# Altium schematic sheet M2Sdut.SchDoc
size Tabloid
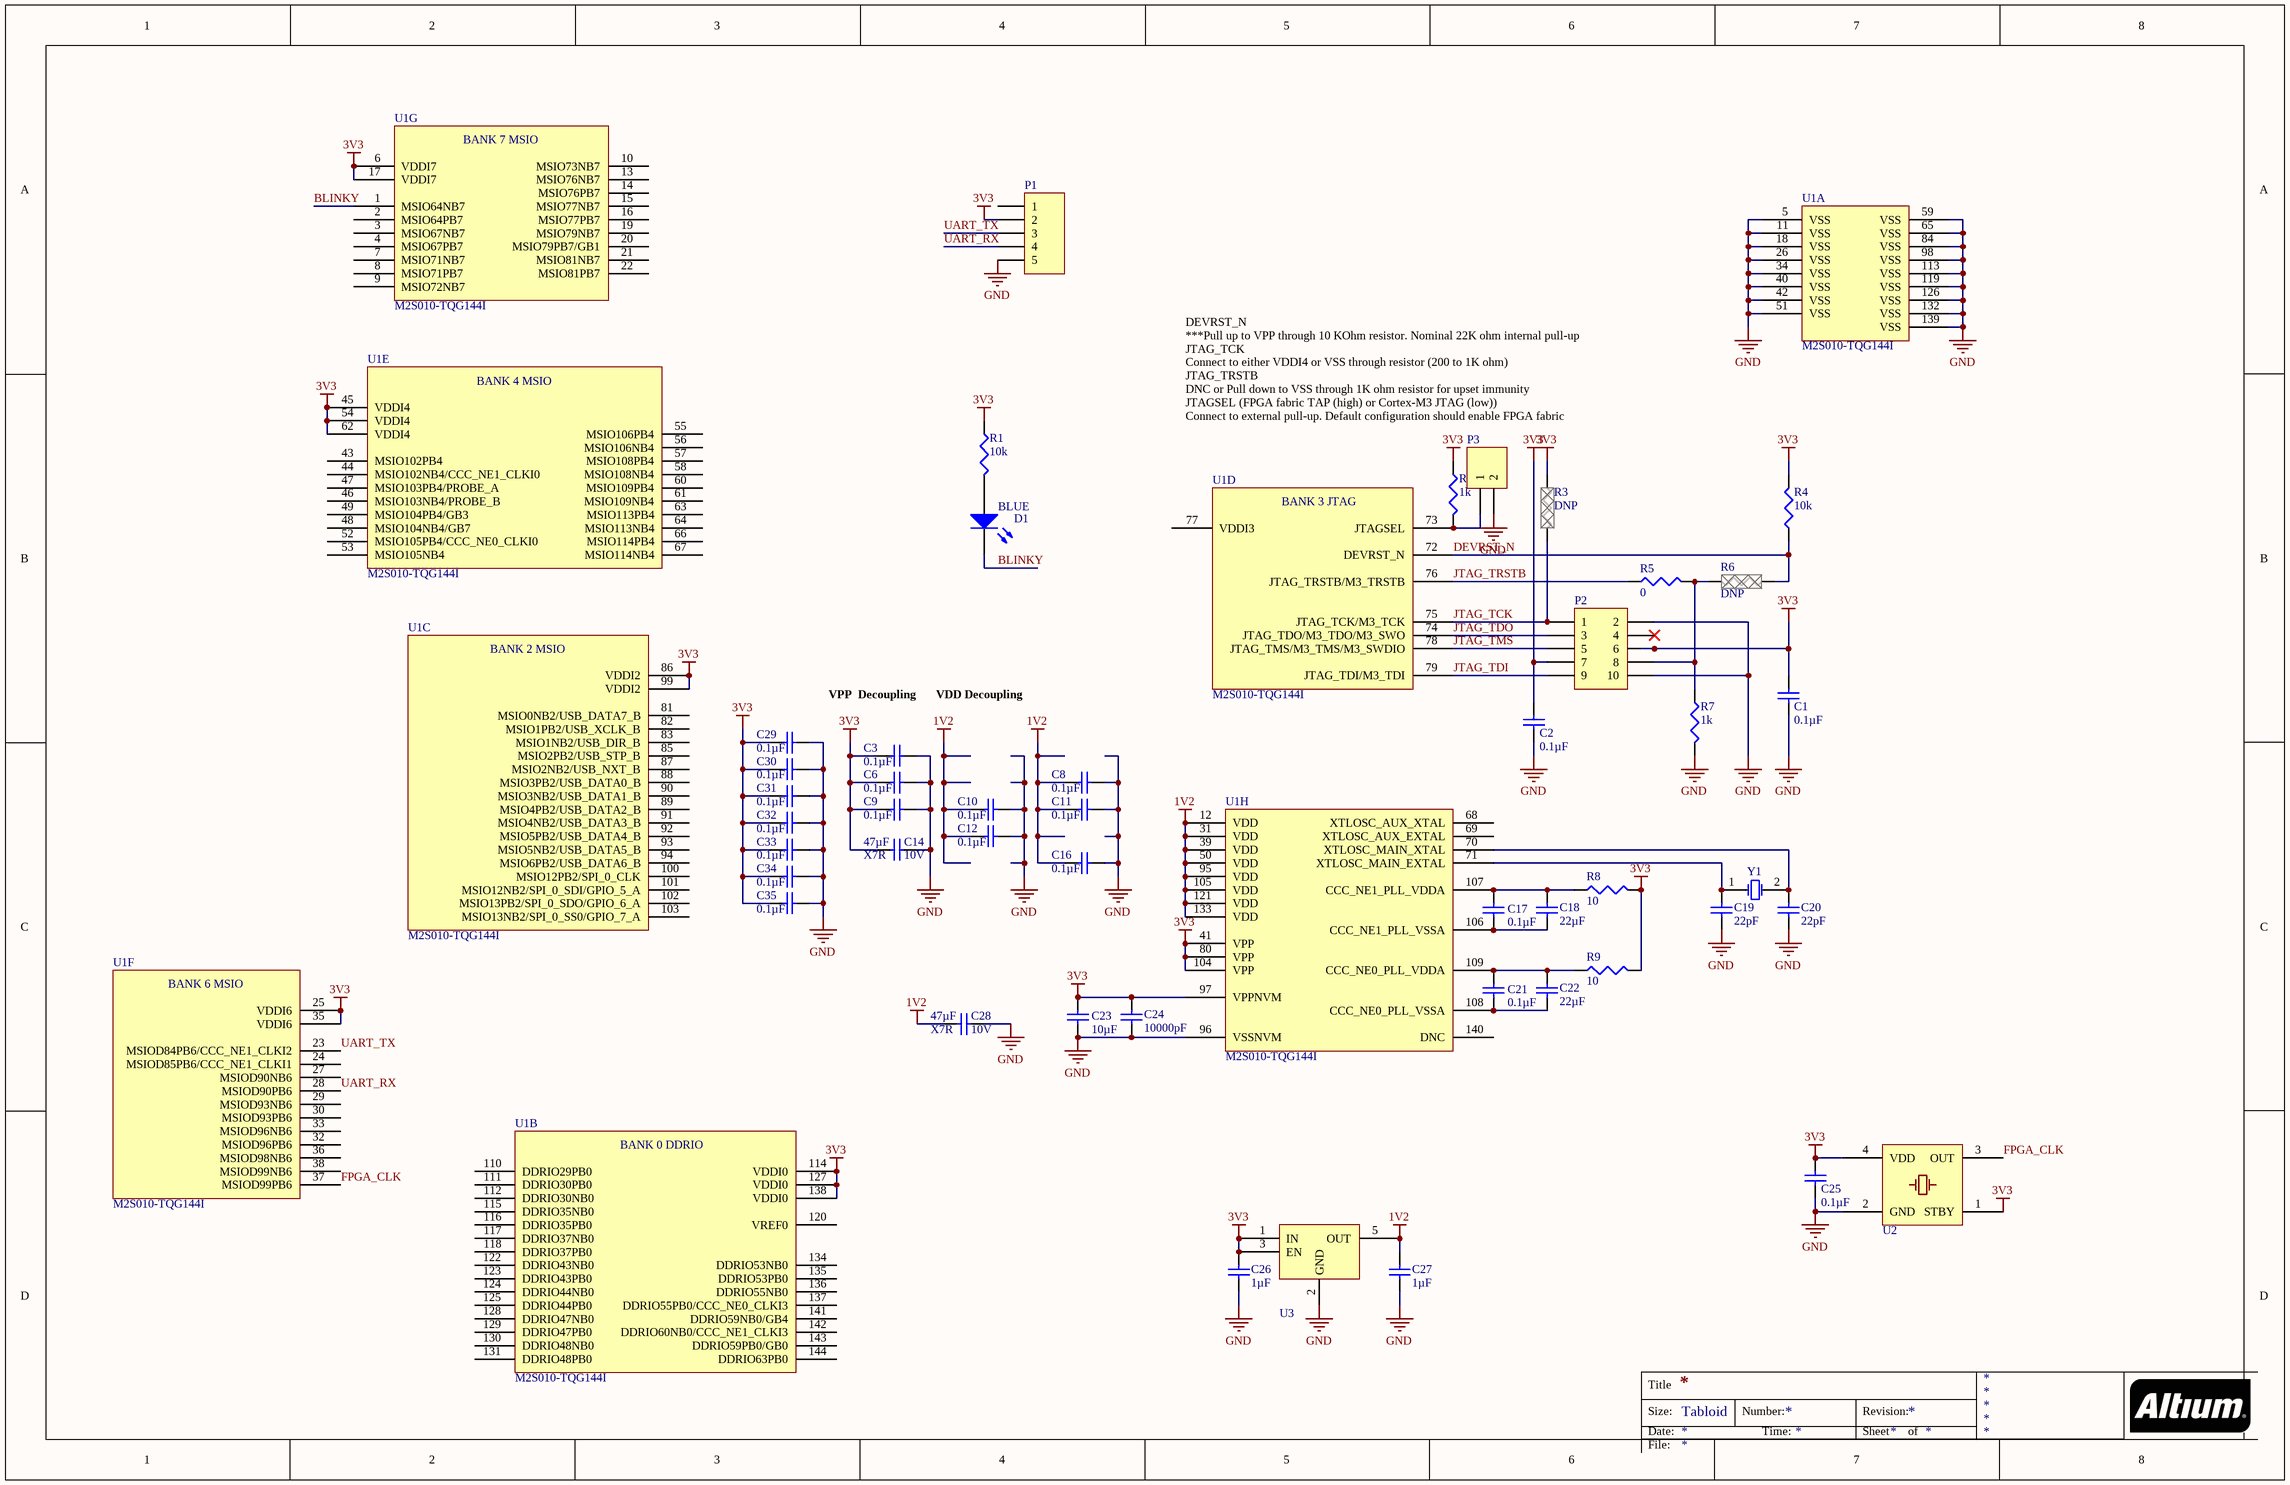
[diagram p0: M2Sdut.SchDoc]

## Parts
C1  value 0.1µF  [TDK-CGA3E]  (hidden comment: Cap)
C2  value 0.1µF  [TDK-CGA3E]  (hidden comment: Cap)
C3  value 0.1µF  [TDK-CGA3E]  (hidden comment: Cap)
C6  value 0.1µF  [TDK-CGA3E]  (hidden comment: Cap)
C8  value 0.1µF  [TDK-CGA3E]  (hidden comment: Cap)
C9  value 0.1µF  [TDK-CGA3E]  (hidden comment: Cap)
C10  value 0.1µF  [TDK-CGA3E]  (hidden comment: Cap)
C11  value 0.1µF  [TDK-CGA3E]  (hidden comment: Cap)
C12  value 0.1µF  [TDK-CGA3E]  (hidden comment: Cap)
C14  value 47µF  Voltage-Rated: 10V  Temperature Coefficient: X7R  [TY-1210M]  (hidden comment: Cap)
C16  value 0.1µF  [TDK-CGA3E]  (hidden comment: Cap)
C17  value 0.1µF  [TDK-CGA3E]  (hidden comment: Cap)
C18  value 22µF  [TY-0805G]  (hidden comment: Cap)
C19  value 22pF  [TDK-CGA3E]  (hidden comment: Cap)
C20  value 22pF  [TDK-CGA3E]  (hidden comment: Cap)
C21  value 0.1µF  [TDK-CGA3E]  (hidden comment: Cap)
C22  value 22µF  [TY-0805G]  (hidden comment: Cap)
C23  value 10µF  [TDK-CGA5L]  (hidden comment: Cap)
C24  value 10000pF  [TDK-CGA3E]  (hidden comment: Cap)
C25  value 0.1µF  [TDK-CGA3E]  (hidden comment: Cap)
C26  value 1µF  [TDK-CGA3E]  (hidden comment: Cap)
C27  value 1µF  [TDK-CGA3E]  (hidden comment: Cap)
C28  value 47µF  Voltage-Rated: 10V  Temperature Coefficient: X7R  [TY-1210M]  (hidden comment: Cap)
C29  value 0.1µF  [TDK-CGA3E]  (hidden comment: Cap)
C30  value 0.1µF  [TDK-CGA3E]  (hidden comment: Cap)
C31  value 0.1µF  [TDK-CGA3E]  (hidden comment: Cap)
C32  value 0.1µF  [TDK-CGA3E]  (hidden comment: Cap)
C33  value 0.1µF  [TDK-CGA3E]  (hidden comment: Cap)
C34  value 0.1µF  [TDK-CGA3E]  (hidden comment: Cap)
C35  value 0.1µF  [TDK-CGA3E]  (hidden comment: Cap)
D1  value BLUE  [WL-150060XS75000]  (hidden comment: LED)
P1  319-10-105-30-054000  [319-10-105-30-054000]  (value not drawn)
P2  Header 5x2  [SLN-GRPB052]  (value not drawn)
P3  Header 2  [SLN-GRPB021]  (value not drawn)
R1  value 10k  [PANA-ERJ3EK]  (hidden comment: Res3)
R2  value 1k  [PANA-ERJ3EK]  (hidden comment: Res3)
R3  DNP  [PANA-ERJ3G]  (no BOM)
R4  value 10k  [PANA-ERJ3EK]  (hidden comment: Res3)
R5  value 0  [PANA-ERJ3G]  (hidden comment: Jumper)
R6  DNP  [PANA-ERJ3G]  (no BOM)
R7  value 1k  [PANA-ERJ3EK]  (hidden comment: Res3)
R8  value 10  [PANA-ERJ3EK]  (hidden comment: Res3)
R9  value 10  [PANA-ERJ3EK]  (hidden comment: Res3)
U1  M2S010-TQG144I  [USEM-TQ144]  (parts A,B,C,D,E,F,G,H of 8)
U2  ASDMB  [ABR-ASDMB]  (value not drawn)
U3  LP5907  [TI-SOT25]  (value not drawn)
Y1  ABS07AIG  [ABR-ABS07AIG]  (value not drawn)

## Nets
1V2: C8.2 C10.2 C11.2 C12.2 C16.2 C27.2 C28.1 U1.12(VDD) U1.31(VDD) U1.39(VDD) U1.50(VDD) U1.95(VDD) U1.105(VDD) U1.121(VDD) U1.133(VDD) U3.5(OUT)
3V3: C1.2 C2.2 C3.2 C6.2 C9.2 C14.1 C23.2 C24.2 C25.2 C26.2 C29.2 C30.2 C31.2 C32.2 C33.2 C34.2 C35.2 P1.2 P2.6 P2.7 R1.2 R2.1 R3.1 R4.1 R8.2 R9.2 U1.6(VDDI7) U1.17(VDDI7) U1.25(VDDI6) U1.35(VDDI6) U1.41(VPP) U1.45(VDDI4) U1.54(VDDI4) U1.62(VDDI4) U1.80(VPP) U1.86(VDDI2) U1.97(VPPNVM) U1.99(VDDI2) U1.104(VPP) U1.114(VDDI0) U1.127(VDDI0) U1.138(VDDI0) U2.1(STBY) U2.4(VDD) U3.1(IN) U3.3(EN)
GND: C1.1 C2.1 C3.1 C6.1 C8.1 C9.1 C10.1 C11.1 C12.1 C14.2 C16.1 C19.1 C20.1 C23.1 C24.1 C25.1 C26.1 C27.1 C28.2 C29.1 C30.1 C31.1 C32.1 C33.1 C34.1 C35.1 P1.5 P2.2 P2.10 P3.2 R7.2 U1.5(VSS) U1.11(VSS) U1.18(VSS) U1.26(VSS) U1.34(VSS) U1.40(VSS) U1.42(VSS) U1.51(VSS) U1.59(VSS) U1.65(VSS) U1.84(VSS) U1.96(VSSNVM) U1.98(VSS) U1.113(VSS) U1.119(VSS) U1.126(VSS) U1.132(VSS) U1.139(VSS) U2.2(GND) U3.2(GND) U3.4(NC)
BLINKY: D1.2(K) U1.1(MSIO64NB7)
DEVRST_N: R4.2 R6.1 U1.72(DEVRST_N)
FPGA_CLK: U1.37(MSIOD99PB6) U2.3(OUT)
JTAG_TCK: P2.1 R3.2 U1.75(JTAG_TCK/M3_TCK)
JTAG_TDI: P2.9 U1.79(JTAG_TDI/M3_TDI)
JTAG_TDO: P2.3 U1.74(JTAG_TDO/M3_TDO/M3_SWO)
JTAG_TMS: P2.5 U1.78(JTAG_TMS/M3_TMS/M3_SWDIO)
JTAG_TRSTB: R5.1 U1.76(JTAG_TRSTB/M3_TRSTB)
UART_RX: P1.4 U1.28(MSIOD90PB6)
UART_TX: P1.3 U1.23(MSIOD84PB6/CCC_NE1_CLKI2)
NetC17_1: C17.1 C18.1 U1.106(CCC_NE1_PLL_VSSA)
NetC17_2: C17.2 C18.2 R8.1 U1.107(CCC_NE1_PLL_VDDA)
NetC19_2: C19.2 U1.71(XTLOSC_MAIN_EXTAL) Y1.1(OSC1)
NetC20_2: C20.2 U1.70(XTLOSC_MAIN_XTAL) Y1.2(OSC2)
NetC21_1: C21.1 C22.1 U1.108(CCC_NE0_PLL_VSSA)
NetC21_2: C21.2 C22.2 R9.1 U1.109(CCC_NE0_PLL_VDDA)
NetD1_1: D1.1(A) R1.1
NetP2_8: P2.8 R5.2 R6.2 R7.1
NetP3_1: P3.1 R2.2 U1.73(JTAGSEL)

Not connected (* = marked no-connect by the designer): P1 1; P2 4*; U1 2(MSIO64PB7) 3(MSIO67NB7) 4(MSIO67PB7) 7(MSIO71NB7) 8(MSIO71PB7) 9(MSIO72NB7) 10(MSIO73NB7) 13(MSIO76NB7) 14(MSIO76PB7) 15(MSIO77NB7) 16(MSIO77PB7) 19(MSIO79NB7) 20(MSIO79PB7/GB1) 21(MSIO81NB7) 22(MSIO81PB7) 24(MSIOD85PB6/CCC_NE1_CLKI1) 27(MSIOD90NB6) 29(MSIOD93NB6) 30(MSIOD93PB6) 32(MSIOD96PB6) 33(MSIOD96NB6) 36(MSIOD98NB6) 38(MSIOD99NB6) 43(MSIO102PB4) 44(MSIO102NB4/CCC_NE1_CLKI0) 46(MSIO103NB4/PROBE_B) 47(MSIO103PB4/PROBE_A) 48(MSIO104NB4/GB7) 49(MSIO104PB4/GB3) 52(MSIO105PB4/CCC_NE0_CLKI0) 53(MSIO105NB4) 55(MSIO106PB4) 56(MSIO106NB4) 57(MSIO108PB4) 58(MSIO108NB4) 60(MSIO109PB4) 61(MSIO109NB4) 63(MSIO113PB4) 64(MSIO113NB4) 66(MSIO114PB4) 67(MSIO114NB4) 68(XTLOSC_AUX_XTAL) 69(XTLOSC_AUX_EXTAL) 77(VDDI3) 81(MSIO0NB2/USB_DATA7_B) 82(MSIO1PB2/USB_XCLK_B) 83(MSIO1NB2/USB_DIR_B) 85(MSIO2PB2/USB_STP_B) 87(MSIO2NB2/USB_NXT_B) 88(MSIO3PB2/USB_DATA0_B) 89(MSIO4PB2/USB_DATA2_B) 90(MSIO3NB2/USB_DATA1_B) 91(MSIO4NB2/USB_DATA3_B) 92(MSIO5PB2/USB_DATA4_B) 93(MSIO5NB2/USB_DATA5_B) 94(MSIO6PB2/USB_DATA6_B) 100(MSIO12PB2/SPI_0_CLK) 101(MSIO12NB2/SPI_0_SDI/GPIO_5_A) 102(MSIO13PB2/SPI_0_SDO/GPIO_6_A) 103(MSIO13NB2/SPI_0_SS0/GPIO_7_A) 110(DDRIO29PB0) 111(DDRIO30PB0) 112(DDRIO30NB0) 115(DDRIO35NB0) 116(DDRIO35PB0) 117(DDRIO37NB0) 118(DDRIO37PB0) 120(VREF0) 122(DDRIO43NB0) 123(DDRIO43PB0) 124(DDRIO44NB0) 125(DDRIO44PB0) 128(DDRIO47NB0) 129(DDRIO47PB0) 130(DDRIO48NB0) 131(DDRIO48PB0) 134(DDRIO53NB0) 135(DDRIO53PB0) 136(DDRIO55NB0) 137(DDRIO55PB0/CCC_NE0_CLKI3) 140(DNC) 141(DDRIO59NB0/GB4) 142(DDRIO60NB0/CCC_NE1_CLKI3) 143(DDRIO59PB0/GB0) 144(DDRIO63PB0)

## Notes on the sheet
- DEVRST_N
  ***Pull up to VPP through 10 KOhm resistor. Nominal 22K ohm internal pull-up
  JTAG_TCK
  Connect to either VDDI4 or VSS through resistor (200 to 1K ohm)
  JTAG_TRSTB
  DNC or Pull down to VSS through 1K ohm resistor for upset immunity
  JTAGSEL (FPGA fabric TAP (high) or Cortex-M3 JTAG (low))
  Connect to external pull-up. Default configuration should enable FPGA fabric
- VPP  Decoupling
- VDD Decoupling
- Title
- Size:
- Date:
- Tabloid
- Number:
- Time:
- Revision:
- Sheet
- of
- File:
- (in symbol 2, part B) BANK 0 DDRIO
- (in symbol 2, part C) BANK 2 MSIO
- (in symbol 2, part D) BANK 3 JTAG
- (in symbol 2, part E) BANK 4 MSIO
- (in symbol 2, part F) BANK 6 MSIO
- (in symbol 2, part G) BANK 7 MSIO

## Library data of the parts
C1-C3 C6 C8-C12 C16 C17 C21 C25 C29-C35 = PC-TDK-02272: CAP CER 0.1UF 50V X8R 0603; Manufacturer Part Number: CGA3E3X8R1H104K080AB; Index: 2272; Tolerance: ±10%; Published: 3/16/2016; LatestRevisionDate: 3/16/2016; LatestRevisionNote: ...; PackageReference: 0603 (1608 Metric); Publisher: AlbertaSat; PackageDescription: Radial Cap, Thru-Hole; 2 Leads; 0.3 in Pin Spacing; Part Number: PC-TDK-02272; Supplier Part Number 1: 445-12606-1-ND; Supplier 1: Digi-key; Supplier Link: http://www.digikey.ca/product-search/en?keywords=445-12606-1-ND; Voltage - Rated: 50V; Temperature Coefficient: X8R; Applications: Automotive
C14 C28 = PC-TY-00765: CAP CER 47UF 10V X7R 1210; Manufacturer Part Number: LMK325B7476MM-TR; Index: 765; Tolerance: ±20%; Published: 3/13/2016; LatestRevisionDate: 3/13/2016; LatestRevisionNote: ...; PackageReference: 1210 (3225 Metric); Publisher: AlbertaSat; PackageDescription: Chip Capacitor, 2-Leads, Body 3.20x2.50mm, IPC Low Density; Part Number: PC-TY-00765; Supplier Part Number 1: 587-2783-1-ND; Supplier 1: Digi-key; Supplier Link: http://www.digikey.ca/product-search/en?keywords=587-2783-1-ND; Application: General Purpose
C18 C22 = PC-TY-00700: CAP CER 22UF 16V X5R 0805; Manufacturer Part Number: EMK212BBJ226MG-T; Index: 700; Designator: C?; Tolerance: ±20%; Published: 2016-03-13; LatestRevisionDate: 2016-03-13; LatestRevisionNote: ...; PackageReference: 0805 (2012 Metric); Publisher: AlbertaSat; PackageDescription: Chip Capacitor, 2-Leads, Body 2.00x1.25mm, IPC Low Density; Part Number: PC-TY-00700; Supplier Part Number 1: 587-3239-1-ND; Supplier 1: Digi-key; Supplier Link: http://www.digikey.ca/product-search/en?keywords=587-3239-1-ND; Voltage-Rated: 16V; Temperature Coefficient: X5R; Application: General Purpose
C19 C20 = PC-TDK-01150: CAP CER 22PF 100V NP0 0603; Manufacturer Part Number: CGA3E2NP02A220J080AA; Index: 1150; Designator: C?; Tolerance: ±5%; Published: 2016-03-16; LatestRevisionDate: 2016-03-16; LatestRevisionNote: ...; PackageReference: 0603 (1608 Metric); Publisher: AlbertaSat; PackageDescription: Radial Cap, Thru-Hole; 2 Leads; 0.3 in Pin Spacing; Part Number: PC-TDK-01150; Supplier Part Number 1: 445-12357-1-ND; Supplier 1: Digi-key; Supplier Link: http://www.digikey.ca/product-search/en?keywords=445-12357-1-ND; Voltage - Rated: 100V; Temperature Coefficient: NP0; Applications: Automotive
C23 = PC-TDK-02917: CAP CER 10UF 25V X7R 1206; Manufacturer Part Number: CGA5L1X7R1E106K160AC; Index: 2917; Tolerance: ±10%; Published: 3/16/2016; LatestRevisionDate: 3/16/2016; LatestRevisionNote: ...; PackageReference: 1206 (3216 Metric); Publisher: AlbertaSat; PackageDescription: Radial Cap, Thru-Hole; 2 Leads; 0.3 in Pin Spacing; Part Number: PC-TDK-02917; Supplier Part Number 1: 445-6990-1-ND; Supplier 1: Digi-key; Supplier Link: http://www.digikey.ca/product-search/en?keywords=445-6990-1-ND; Voltage - Rated: 25V; Temperature Coefficient: X7R; Applications: Automotive
C24 = PC-TDK-01883: CAP CER 10000PF 100V C0G 0603; Manufacturer Part Number: CGA3E1C0G2A103J080AC; Index: 1883; Designator: C?; Tolerance: ±5%; Temperature Coefficient: NP0; Published: 3/16/2016; LatestRevisionDate: 3/16/2016; LatestRevisionNote: ...; PackageReference: 0603 (1608 Metric); Publisher: AlbertaSat; PackageDescription: Radial Cap, Thru-Hole; 2 Leads; 0.3 in Pin Spacing; Part Number: PC-TDK-01883; Supplier Part Number 1: 445-172688-1-ND; Supplier 1: Digi-key; Supplier Link: http://www.digikey.ca/product-search/en?keywords=445-172688-1-ND; Voltage - Rated: 100V; Applications: Automotive
C26 C27 = PC-TDK-02606: CAP CER 1UF 25V X7R 0603; Manufacturer Part Number: CGA3E1X7R1E105M080AC; Index: 2606; Designator: C?; Tolerance: ±20%; Published: 3/16/2016; LatestRevisionDate: 3/16/2016; LatestRevisionNote: ...; PackageReference: 0603 (1608 Metric); Publisher: AlbertaSat; PackageDescription: Radial Cap, Thru-Hole; 2 Leads; 0.3 in Pin Spacing; Part Number: PC-TDK-02606; Supplier Part Number 1: 445-12548-1-ND; Supplier 1: Digi-key; Supplier Link: http://www.digikey.ca/product-search/en?keywords=445-12548-1-ND; Voltage - Rated: 25V; Temperature Coefficient: X7R; Applications: Automotive
D1 = 4: LED BLUE CLEAR 0603 SMD; Part Number: 4; Manufacturer Part Number: 150060BS75000; Designator: D?; Brightness: 145mcd; Published: 8-Jun-2000; LatestRevisionDate: 08-Jul-2005; LatestRevisionNote: Mech Layer 1 removed.; PackageReference: WL-150060XS75000; Publisher: Altium Limited; PackageDescription: LED; 2 Leads; Supplier Part Number 1: 732-4966-1-ND; Supplier 1: Digi-Key; Supplier Link: http://www.digikey.ca/product-search/en?keywords=732-4966-1-ND
P1 = PP-MMM-00002: LOW PROFILE SLC TARGET CONNECTOR; Index: 2; Designator: P?; LatestRevisionDate: 2018-05-10; LatestRevisionNote: ...; Publisher: AlbertaSat; Part Number: PP-MMM-00002; Manufacturer Part Number: 319-10-105-30-054000; Supplier Part Number 1: ED10781-ND; Supplier 1: Digi-key; Supplier Part Number 2: 575-3191010530054000; Supplier 2: Mouser; Published: 2018-05-10; Supplier Link: #https://www.digikey.ca/product-detail/en/mill-max-manufacturing-corp/319-10-105-30-054000/ED10781-ND/6243896#
P2 = PP-SLN-00017: CONN HEADER .050"" 10PS DL PCB AU; Manufacturer Part Number: GRPB052VWVN-RC; Index: 17; Designator: P?; Number of Positions: 10; Pitch: 0.050" (1.27mm); LatestRevisionDate: 2016-03-16; LatestRevisionNote: ...; Publisher: AlbertaSat; Part Number: PP-SLN-00017; Supplier Part Number 1: S9015E-05-ND; Supplier 1: Digi-key; Published: 2016-03-16; PackageReference: SLN-GRPB052; PackageDescription: CONN HEADER .050"" 10PS DL PCB AU; Supplier Link: http://www.digikey.ca/product-search/en?keywords=S9015E-05-ND; Number of Rows: 2
P3 = PP-SLN-00001: CONN HEADER .050"" 3POS PCB GOLD; Manufacturer Part Number: GRPB021VWVN-RC; Index: 1; Designator: P?; Number of Positions: 2; Pitch: 0.050" (1.27mm); LatestRevisionDate: 2016-03-15; LatestRevisionNote: ...; Publisher: AlbertaSat; Part Number: PP-SLN-00001; Supplier Part Number 1: S9014E-02-ND; Supplier 1: Digi-key; Published: 2016-03-15; PackageReference: SLN-GRPB021; PackageDescription: CONN HEADER .050"" 3POS PCB GOLD; Supplier Link: http://www.digikey.ca/product-search/en?keywords=S9014E-02-ND; Number of Rows: 1
R1 R4 = 17203: RES SMD 10K OHM 1% 1/10W 0603; Part Number: 17203; Manufacturer Part Number: ERJ-3EKF1002V; Designator: R?; Power: 0.1W, 1/10W; Temperature Coefficient: ±100ppm/°C; Published: 8-Jun-2000; LatestRevisionDate: 29-May-2009; LatestRevisionNote: IPC-7351 Footprint Added.; PackageReference: 0603 (1608 Metric); Publisher: Altium Limited; PackageDescription: Chip Resistor, 2-Leads, Body 1.60x0.80mm, IPC Low Density; Supplier Part Number 1: P10.0KHCT-ND; Supplier 1: Digi-Key; Supplier Link: http://www.digikey.ca/product-search/en?keywords=P10.0KHCT-ND; Tolerance: ±1%
R2 R7 = 15398: RES SMD 1K OHM 1% 1/10W 0603; Part Number: 15398; Manufacturer Part Number: ERJ-3EKF1001V; Designator: R?; Power: 0.1W, 1/10W; Temperature Coefficient: ±100ppm/°C; Published: 8-Jun-2000; LatestRevisionDate: 29-May-2009; LatestRevisionNote: IPC-7351 Footprint Added.; PackageReference: 0603 (1608 Metric); Publisher: Altium Limited; PackageDescription: Chip Resistor, 2-Leads, Body 1.60x0.80mm, IPC Low Density; Supplier Part Number 1: P1.00KHCT-ND; Supplier 1: Digi-Key; Supplier Link: http://www.digikey.ca/product-search/en?keywords=P1.00KHCT-ND; Tolerance: ±1%
R3 R6 = 19770: Part Number: 19770; Value: DNP; PackageReference: 0603 (1608 Metric); PackageDescription: Chip Resistor, 2-Leads, Body 1.60x0.80mm, IPC Low Density
R5 = 13128: RES SMD 0.0OHM JUMPER 1/10W 0603; Part Number: 13128; Manufacturer Part Number: ERJ-3GEY0R00V; Designator: R?; Power: 0.1W, 1/10W; PackageDescription: Chip Resistor, 2-Leads, Body 1.60x0.80mm, IPC Low Density; Supplier Part Number 1: P0.0GCT-ND; Supplier 1: Digi-Key; Supplier Link: http://www.digikey.ca/product-search/en?keywords=P0.0GCT-ND; PackageReference: 0603 (1608 Metric); Tolerance: Jumper; Temperature Coefficient: -; Type: Jumper
R8 R9 = 13237: RES SMD 10 OHM 1% 1/10W 0603; Part Number: 13237; Manufacturer Part Number: ERJ-3EKF10R0V; Designator: R?; Power: 0.1W, 1/10W; Temperature Coefficient: ±100ppm/°C; Published: 8-Jun-2000; LatestRevisionDate: 29-May-2009; LatestRevisionNote: IPC-7351 Footprint Added.; PackageReference: 0603 (1608 Metric); Publisher: Altium Limited; PackageDescription: Chip Resistor, 2-Leads, Body 1.60x0.80mm, IPC Low Density; Supplier Part Number 1: P10.0HCT-ND; Supplier 1: Digi-Key; Supplier Link: http://www.digikey.ca/product-search/en?keywords=P10.0HCT-ND; Tolerance: ±1%
U1 = 2: FPGA - Field Programmable Gate Array SmartFusion2; Part Number: 2; Designator: U?; Supplier Part Number 1: 494-M2S010-TQG144I; Supplier 1: Mouser; Supplier Link: #https://www.mouser.ca/ProductDetail/Microsemi/M2S010-TQG144I?qs=%2fha2pyFadugM83NRZLB13twt09wJ9LTl%252bO3Kq6punH4sfPCbZRySdxgl6DnwIFRK#
U2 = PU-ABR-00011: OSC MEMS 10.000MHZ CMOS SMD; Manufacturer Part Number: ASDMB-10.000MHZ-XY-T; Index: 11; Designator: U?; Value: 10MHz; Tolerance: ±10ppm; Part Number: PU-ABR-00011; Supplier Part Number 1: 535-11171-1-ND; Supplier 1: Digi-key; Supplier Part Number 2: 815-ASDMB-10-XY-T; Supplier 2: Mouser; Publisher: AlbertaSat; Published: 2017-10-24; LatestRevisionDate: 2017-10-24; LatestRevisionNote: ...; PackageReference: 4-SMD, No Lead; PackageDescription: DFN, 4-Leads, Body 2.00x2.50mm, Pitch 1.65mm, IPC Low Density; Supplier Link: http://www.digikey.ca/product-search/en?keywords=535-11171-1-ND
U3 = 22: IC REG LINEAR 1.2V 250MA SOT23-5; Part Number: 22; Manufacturer Part Number: LP5907QMFX-1.2Q1; Designator: U?; Supplier Part Number 1: 296-40360-1-ND; Supplier 1: Digi-Key; Supplier Link: http://www.digikey.ca/product-search/en?keywords=296-40360-1-ND; Value: 1.2V; PackageReference: TI-SOT25
Y1 = PY-ABR-00004: CRYSTAL 32.768KHZ 12.5PF SMD; Manufacturer Part Number: ABS07AIG-32.768KHZ-1-T; Index: 4; Designator: Y?; Tolerance: ±10ppm; Equivalent Series Resistance: 70 kOhm; Published: 2017-04-29; LatestRevisionDate: 2017-04-29; LatestRevisionNote: ...; PackageReference: 2-SMD, No Lead; Publisher: AlbertaSat; PackageDescription: 0.126" L x 0.059" W (3.20mm x 1.50mm); Part Number: PY-ABR-00004; Supplier Part Number 1: 535-13352-1-ND; Supplier 1: Digi-key; Supplier Part Number 2: 815-S07AIG-32.768-1T; Supplier 2: Mouser; Supplier Link: http://www.digikey.ca/product-search/en?keywords=535-13352-1-ND; Value: 32.768kHz; Applications: Automotive; Load Capacitance: 12.5pF